# Altium project ROB_450_DAUGHTER.PrjPcb
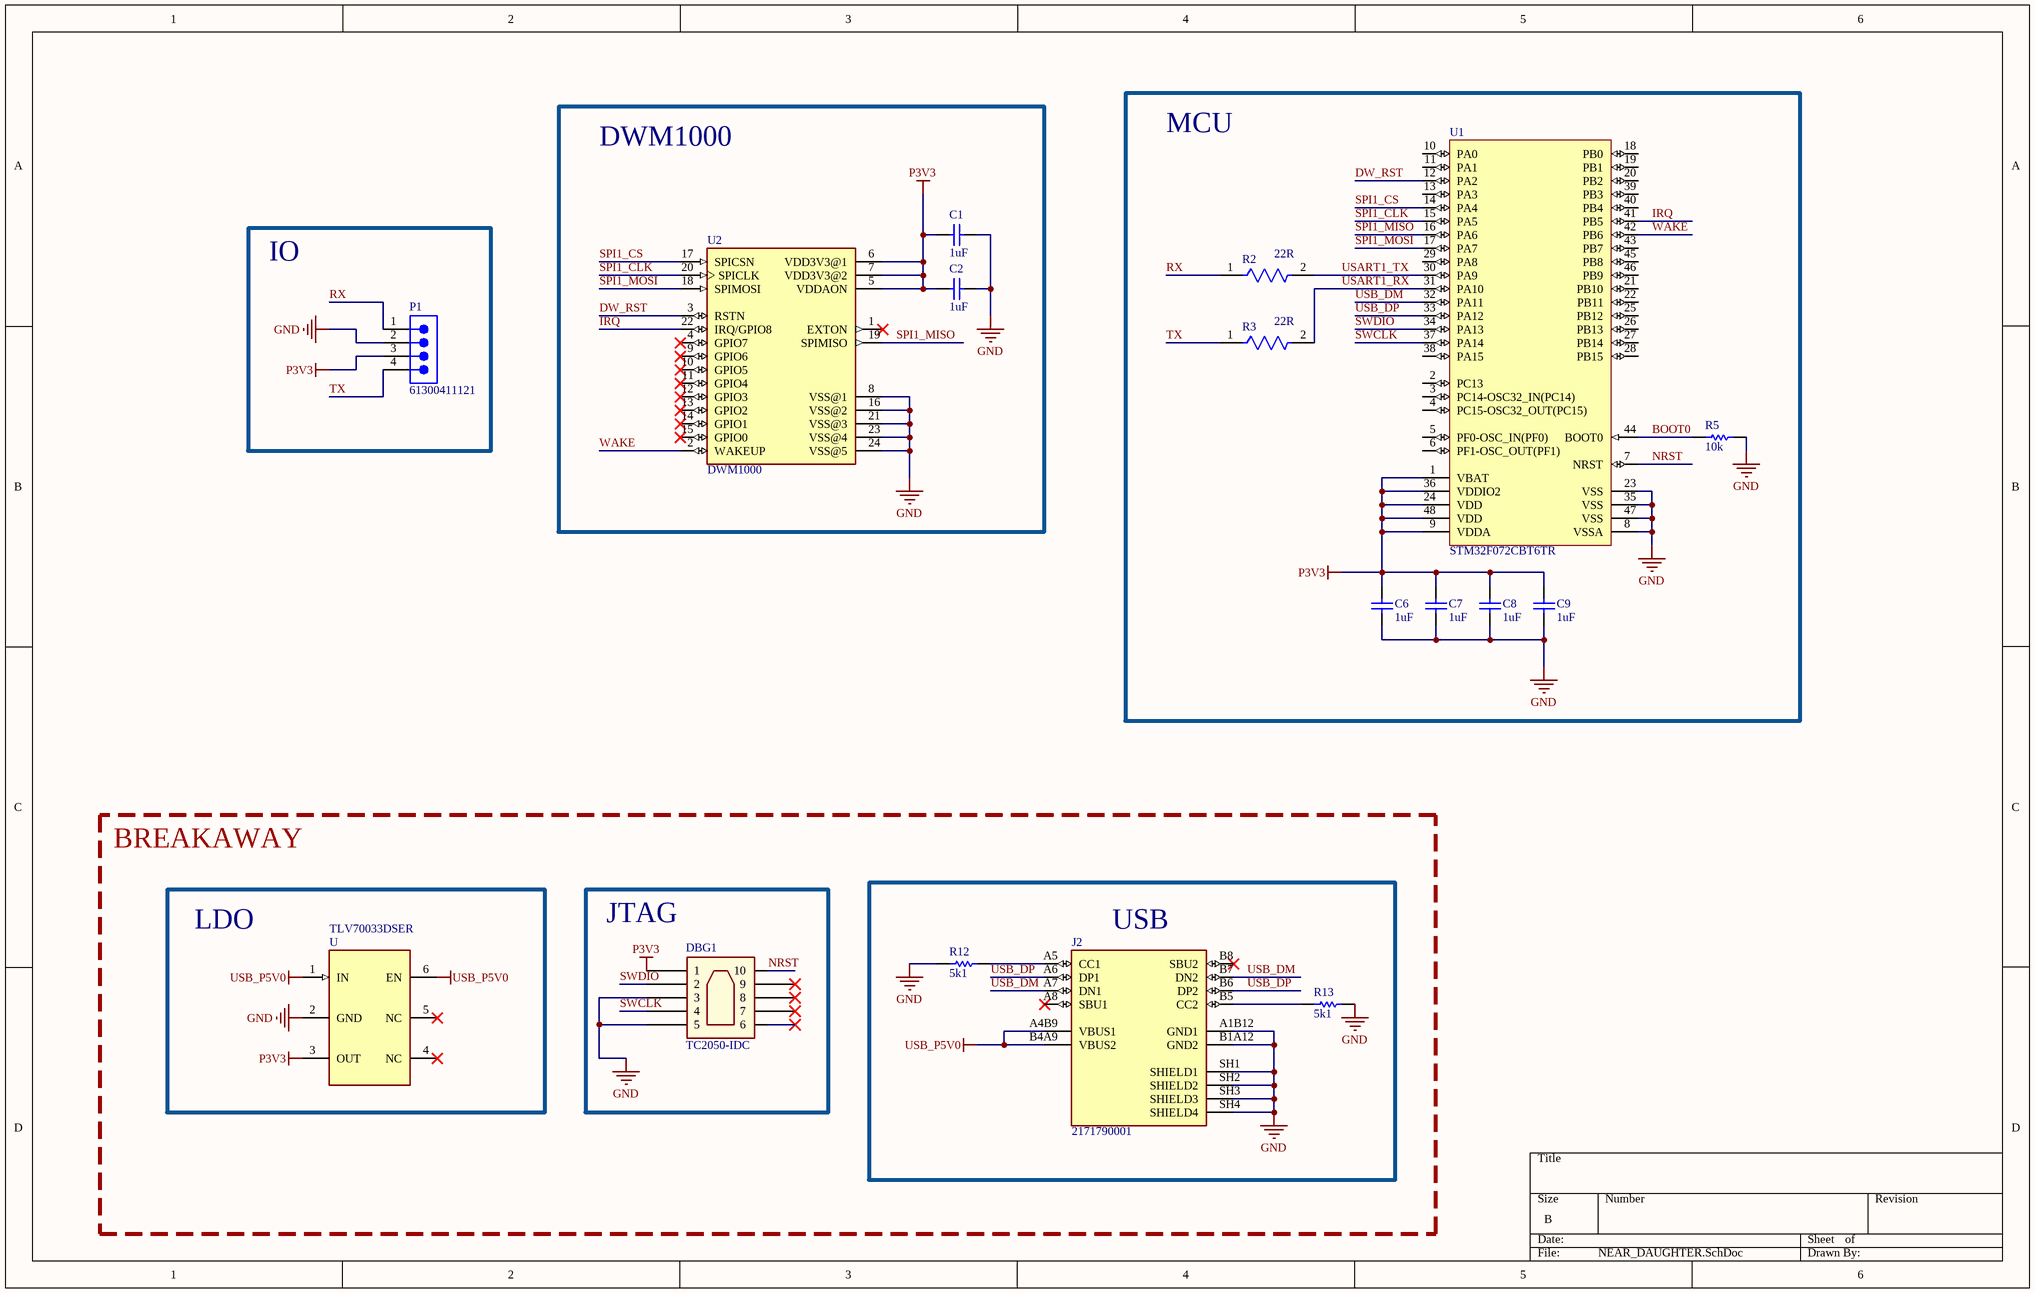
[diagram p0: NEAR_DAUGHTER.SchDoc]
1 sheet, 17 parts. Net scope: global (net labels, ports and power ports of the same name join across sheets).
Board file: NEAR_DAUGHTER.PcbDoc

## Sheet NEAR_DAUGHTER.SchDoc
size B; SheetNumber: 1; SheetTotal: 1

### Parts
C1  1uF  [CAP_0603]
C2  1uF  [CAP_0603]
C6  1uF  [CAP_0603]
C7  1uF  [CAP_0603]
C8  1uF  [CAP_0603]
C9  1uF  [CAP_0603]
DBG1  TC2050-IDC  [TC2050-IDC-Footprint-2]
J2  2171790001  [MOLEX_2171790001]
P1  61300411121  [61300411121]
R2  22R  [FP-CPF0603-MFG]
R3  22R  [FP-CPF0603-MFG]
R5  10k  [RESC1609X55X30LL15T15]
R12  5k1  [RESC1608X55X25ML10T15]
R13  5k1  [RESC1608X55X25ML10T15]
U  TLV70033DSER  [SON50P150X150X80-6N]
U1  STM32F072CBT6TR  [STM-LQFP48_M]
U2  DWM1000  [XCVR_DWM1000]

### Blocks framed on the sheet
DWM1000: C1 C2 U2
MCU: C6-C9 R2 R3 R5 U1
IO: P1
USB: J2 R12 R13
LDO: U
JTAG: DBG1

### Nets
GND: C1.2 C2.2 C6.1 C7.1 C8.1 C9.1 DBG1.3 DBG1.5 J2.A1B12(GND1) J2.B1A12(GND2) J2.SH1(SHIELD1) J2.SH2(SHIELD2) J2.SH3(SHIELD3) J2.SH4(SHIELD4) P1.2 R5.1 R12.2 R13.1 U.2(GND) U1.8(VSSA) U1.23(VSS) U1.35(VSS) U1.47(VSS) U2.8(VSS@1) U2.16(VSS@2) U2.21(VSS@3) U2.23(VSS@4) U2.24(VSS@5)
P3V3: C1.1 C2.1 C6.2 C7.2 C8.2 C9.2 DBG1.1 P1.3 U.3(OUT) U1.1(VBAT) U1.9(VDDA) U1.24(VDD) U1.36(VDDIO2) U1.48(VDD) U2.5(VDDAON) U2.6(VDD3V3@1) U2.7(VDD3V3@2)
USB_P5V0: J2.A4B9(VBUS1) J2.B4A9(VBUS2) U.1(IN) U.6(EN)
BOOT0: R5.2 U1.44(BOOT0)
DW_RST: U1.12(PA2) U2.3(RSTN)
IRQ: U1.41(PB5) U2.22(IRQ/GPIO8)
NRST: DBG1.10 U1.7(NRST)
RX: P1.1 R2.1
SPI1_CLK: U1.15(PA5) U2.20(SPICLK)
SPI1_CS: U1.14(PA4) U2.17(SPICSN)
SPI1_MISO: U1.16(PA6) U2.19(SPIMISO)
SPI1_MOSI: U1.17(PA7) U2.18(SPIMOSI)
SWCLK: DBG1.4 U1.37(PA14)
SWDIO: DBG1.2 U1.34(PA13)
TX: P1.4 R3.1
USART1_RX: R3.2 U1.31(PA10)
USART1_TX: R2.2 U1.30(PA9)
USB_DM: J2.A7(DN1) J2.B7(DN2) U1.32(PA11)
USB_DP: J2.A6(DP1) J2.B6(DP2) U1.33(PA12)
WAKE: U1.42(PB6) U2.2(WAKEUP)
NetJ2_A5: J2.A5(CC1) R12.1
NetJ2_B5: J2.B5(CC2) R13.2

Not connected (* = marked no-connect by the designer): DBG1 6* 7* 8* 9*; J2 A8(SBU1)* B8(SBU2)*; U 4(NC)* 5(NC)*; U1 2(PC13) 3(PC14-OSC32_IN(PC14)) 4(PC15-OSC32_OUT(PC15)) 5(PF0-OSC_IN(PF0)) 6(PF1-OSC_OUT(PF1)) 10(PA0) 11(PA1) 13(PA3) 18(PB0) 19(PB1) 20(PB2) 21(PB10) 22(PB11) 25(PB12) 26(PB13) 27(PB14) 28(PB15) 29(PA8) 38(PA15) 39(PB3) 40(PB4) 43(PB7) 45(PB8) 46(PB9); U2 1(EXTON)* 4(GPIO7)* 9(GPIO6)* 10(GPIO5)* 11(GPIO4)* 12(GPIO3)* 13(GPIO2)* 14(GPIO1)* 15(GPIO0)*

### Notes on the sheet
- BREAKAWAY

### Library data of the parts
C1 C2 C6-C9 = CMP-001-00097-1: Cap Ceramic 1uF 25V X7R 10% Pad SMD 0603 125C Automotive T/R; Voltage Rating: 25V; Case/Package: 0603; Capacitance: 1uF; Dielectric: X7R; Tolerance: 10%
DBG1 = CMP-002-00071-4: CBL PLUG-OF-NAILS 10-PIN W/LEGS
J2 = CMP-002-00656-1: USB Type C - Connector, Top-mount SMT, 16pos; MP: 217179-0001; MF: Molex; Check_prices: https://www.snapeda.com/parts/217179-0001/Molex/view-part/?ref=eda; Design Item ID: 2171790001; Value: *; Source: 2171790001.SchLib; Case/Package: None; SnapEDA_Link: https://www.snapeda.com/parts/217179-0001/Molex/view-part/?ref=snap
P1 = CMP-002-00283-1: WR-PHD Pin Header, THT, Vertical, pitch 2.54mm, 1 Row, 4P; Manufacturer: Wurth Elektronik; Contact Resistance: 20mOhm; Working Voltage: 250V; Withstanding Voltage: 500V; Rated Current: 3A; Mount: Through Hole; Manufacturer Part Number: 61300411121; Orientation: Vertical; ComponentLink1URL: https://www.we-online.com/redexpert/article/61300411121?ad; ComponentLink1Description: Website Link; Number of Rows: 1; Pin Count: 4; Pins: 4; Pitch: 2.54mm; ComponentLink2URL: https://www.we-online.com/redexpert/spec/61300411121?ad; Operating Temperature Max: 105°C; Design Item ID: 61300411121; ComponentLink2Description: Datasheet Link; Category: Board-to-Board Connectors; Operating Temperature Min: -40°C; Packaging: Bag; Component Type: Standard; Source: WR-PHD.SchLib; Match Code: WR-PHD; Gender: Pin Header
R2 R3 = CMP-03211-007811-1: RES SMD 22Ω 0.1% 1/16W 0603; Manufacturer: TE Connectivity; Manufacturer Part Number: CPF0603B22RE1; Temperature Coefficient: 25ppm/°C; Power Rating: 0.063W; Voltage Rating: 50V; Automotive: No; ComponentLink2Description: Datasheet; Package: CPF0603; Temperature Range High: +155°C; Device Class L1: Passive Components; Resistance: 22Ω; Device Class L3: Chip SMD Resistors; packaging: 1k Reel; Temperature: -55°C to +155°C; Octopart: https://octopart.com/cpf0603b22re1-te+connectivity-9539398; ComponentLink2URL: https://www.te.com/commerce/DocumentDelivery/DDEController?Action=showdoc&DocId=Data+Sheet%7F1773200%7FM%7Fpdf%7FEnglish%7FENG_DS_1773200_M.pdf%7F3-1676481-2; Value: 22Ω; Device Class L2: Resistors; Height: 0.55mm; RoHS: TRUE; Composition: Thin Film; Lead Free: Yes; octopart_url: https://octopart.com/cpf0603b22re1-te+connectivity-9539398; Tolerance: 0.1%; Ipc Land Pattern Name: RESC15580X45; Category: Res; Temperature Range Low: -55°C; Series: CPF
R5 = CMP-1012-00623-3: Chip Resistor, 10 KOhm, +/- 1%, 0.1 W, -55 to 155 degC, 0603 (1608 Metric), RoHS, Tape and Reel; Manufacturer: Panasonic; Voltage Rating: 75V; Case\/Package: 0603; Power Rating: 100mW; Resistance: 10KOhm; Temperature Coefficient: 100ppm\/degreesC; Number of Pins: 2; Package Reference: 603; Depth: 0.8mm; Mount: SurfaceMount; Package Description: 2-Pin Surface Mount Device, Body 1.6 x 0.85 mm; Datasheet Version: 02/2017; Length: 1.6mm; Lead Free: LeadFree; Height: 0.45mm; Number of Terminations: 2; Max Power Dissipation: 100mW; Min Operating Temperature: -55degC; Datasheet URL: https://industrial.panasonic.com/cdbs/www-data/pdf/RDA0000/AOA0000C304.pdf; Termination: SMD/SMT; Case Code (Metric): 1608; Case Code (Imperial): 0603; Tolerance: 1%; Max Operating Temperature: 155degC; RoHSCompliant: true; Voltage Rating (DC): 75V; Radiation Hardening: No; Packaging: TapeandReel; Composition: ThickFilm; Mounting Technology: SurfaceMount; Manufacturer URL: http://www.panasonic.com/; Width: 0.031inch; REACH SVHC: NoSVHC; Contact Plating: Tin; Military Standard: Not; Package Quantity: 1
R12 R13 = CMP-2000-04091-1: Manufacturer: Yageo; Part Number: RC0603FR-075K1L
U = CMP-019-00083-5: Linear Voltage Regulator IC 1 Output 200mA 6-WSON _1.5x1.5_; MF: Texas Instruments; Case/Package: WFDFN-6 Texas Instruments; SnapEDA_Link: https://www.snapeda.com/parts/TLV70033DSER/Texas%20Instruments/view-part/562119/?ref=snap; Component Type: Standard; MP: TLV70033DSER; Value: *; Availability: Unavailable; Source: SnapEDAsch.SchLib; Design Item ID: TLV70033DSER; Pins: 4; Price: None
U1 = CMP-0304-00171-1: ARM Cortex-M0 32-bit MCU, 128 KB Flash, 16 KB Internal RAM, 37 I/Os, 48-Pin LQFP, -40 to 85 degC, Tape and Reel; FLASH Size (Prog) (kB): 128; D/A Converter: 1; Operating Frequency(F) (Processor speed) (MHz): 48; Supply Voltage(Vcc) min (V): 2; I/Os (High Current): 37; Internal RAM Size (kB): 16; ComponentLink1URL: http://www.st.com/; DatasheetVersion: Rev. 5; Mounting Technology: Surface Mount; Packing: Tape and Reel; ComponentLink2Description: Datasheet; ComponentLink2URL: http://www.st.com/st-web-ui/static/active/en/resource/technical/document/datasheet/DM00090510.pdf; ComponentLink1Description: Manufacturer URL; Package Reference: LQFP48; Core: ARM Cortex-M0; Package Description: 48-Pin Low Profile Quad Flat Package, Body 7 x 7 mm, Pitch 0.5 mm
U2 = CMP-236-000000-2: 802.15.4 IR-UWB Transceiver Module 3.5GHz ~ 6.5GHz Integrated, Chip Surface Mount; MF: Decawave Limited; Package: Module Decawave; Source: SnapEDAsch.SchLib; Availability: Unavailable; Component Type: Standard; Price: None; Value: *; SnapEDA_Link: https://www.snapeda.com/parts/DWM1000/Decawave%20Limited/view-part/327593/?ref=snap; MP: DWM1000; Pin Count: 24; Design Item ID: DWM1000